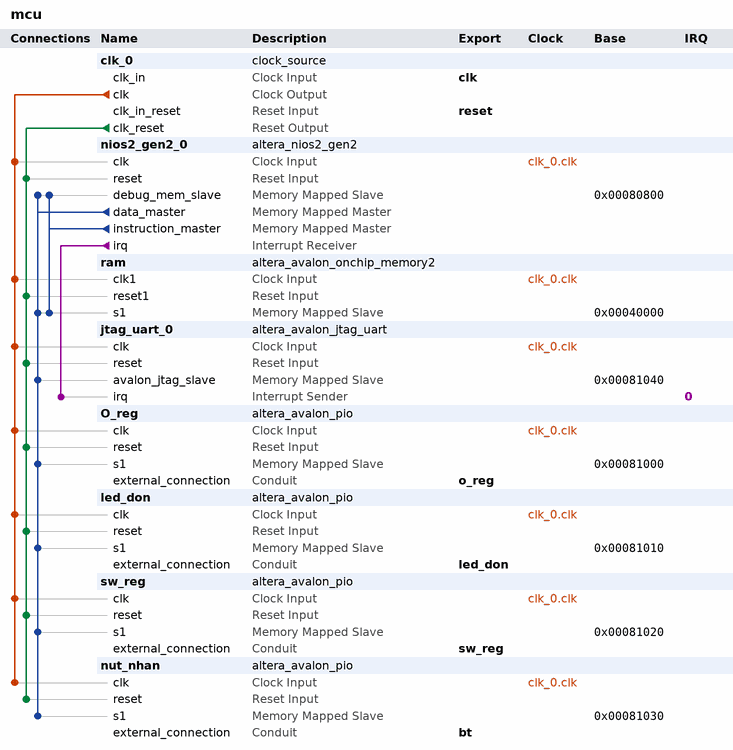
[diagram p0: system contents]
# Platform Designer (Qsys) system mcu, Cyclone IV E EP4CE115F29C7
# Parameters at their usual value, and those the tool derives, are not listed.
package require -exact qsys 17.1
create_system mcu
set_project_property DEVICE_FAMILY {Cyclone IV E}
set_project_property DEVICE EP4CE115F29C7

add_instance clk_0 clock_source 17.1
set_instance_parameter_value clk_0 clockFrequency 50000000

add_instance nios2_gen2_0 altera_nios2_gen2 17.1
set_instance_parameter_value nios2_gen2_0 dcache_size 2048
set_instance_parameter_value nios2_gen2_0 exceptionSlave ram.s1
set_instance_parameter_value nios2_gen2_0 icache_size 4096
set_instance_parameter_value nios2_gen2_0 impl Tiny
set_instance_parameter_value nios2_gen2_0 resetSlave ram.s1

add_instance ram altera_avalon_onchip_memory2 17.1
set_instance_parameter_value ram dataWidth 32
set_instance_parameter_value ram dualPort false
set_instance_parameter_value ram initMemContent true
set_instance_parameter_value ram initializationFileName onchip_mem.hex
set_instance_parameter_value ram memorySize 204800

add_instance jtag_uart_0 altera_avalon_jtag_uart 17.1
set_instance_parameter_value jtag_uart_0 simInteractiveOptions NO_INTERACTIVE_WINDOWS

add_instance O_reg altera_avalon_pio 17.1
set_instance_parameter_value O_reg direction Output
set_instance_parameter_value O_reg width 8

add_instance led_don altera_avalon_pio 17.1
set_instance_parameter_value led_don direction Output
set_instance_parameter_value led_don width 1

add_instance sw_reg altera_avalon_pio 17.1
set_instance_parameter_value sw_reg direction Input
set_instance_parameter_value sw_reg width 3

add_instance nut_nhan altera_avalon_pio 17.1
set_instance_parameter_value nut_nhan direction Input
set_instance_parameter_value nut_nhan width 1

# connections
add_connection clk_0.clk jtag_uart_0.clk clock
add_connection clk_0.clk led_don.clk clock
add_connection clk_0.clk nios2_gen2_0.clk clock
add_connection clk_0.clk nut_nhan.clk clock
add_connection clk_0.clk O_reg.clk clock
add_connection clk_0.clk ram.clk1 clock
add_connection clk_0.clk sw_reg.clk clock
add_connection clk_0.clk_reset jtag_uart_0.reset reset
add_connection clk_0.clk_reset led_don.reset reset
add_connection clk_0.clk_reset nios2_gen2_0.reset reset
add_connection clk_0.clk_reset nut_nhan.reset reset
add_connection clk_0.clk_reset O_reg.reset reset
add_connection clk_0.clk_reset ram.reset1 reset
add_connection clk_0.clk_reset sw_reg.reset reset
add_connection nios2_gen2_0.data_master jtag_uart_0.avalon_jtag_slave avalon
set_connection_parameter_value nios2_gen2_0.data_master/jtag_uart_0.avalon_jtag_slave baseAddress 0x00081040
add_connection nios2_gen2_0.data_master led_don.s1 avalon
set_connection_parameter_value nios2_gen2_0.data_master/led_don.s1 baseAddress 0x00081010
add_connection nios2_gen2_0.data_master nios2_gen2_0.debug_mem_slave avalon
set_connection_parameter_value nios2_gen2_0.data_master/nios2_gen2_0.debug_mem_slave baseAddress 0x00080800
add_connection nios2_gen2_0.data_master nut_nhan.s1 avalon
set_connection_parameter_value nios2_gen2_0.data_master/nut_nhan.s1 baseAddress 0x00081030
add_connection nios2_gen2_0.data_master O_reg.s1 avalon
set_connection_parameter_value nios2_gen2_0.data_master/O_reg.s1 baseAddress 0x00081000
add_connection nios2_gen2_0.data_master ram.s1 avalon
set_connection_parameter_value nios2_gen2_0.data_master/ram.s1 baseAddress 0x00040000
add_connection nios2_gen2_0.data_master sw_reg.s1 avalon
set_connection_parameter_value nios2_gen2_0.data_master/sw_reg.s1 baseAddress 0x00081020
add_connection nios2_gen2_0.instruction_master nios2_gen2_0.debug_mem_slave avalon
set_connection_parameter_value nios2_gen2_0.instruction_master/nios2_gen2_0.debug_mem_slave baseAddress 0x00080800
add_connection nios2_gen2_0.instruction_master ram.s1 avalon
set_connection_parameter_value nios2_gen2_0.instruction_master/ram.s1 baseAddress 0x00040000
add_connection nios2_gen2_0.irq jtag_uart_0.irq interrupt
set_connection_parameter_value nios2_gen2_0.irq/jtag_uart_0.irq irqNumber 0

# exported interfaces
add_interface bt conduit end
set_interface_property bt EXPORT_OF nut_nhan.external_connection
add_interface clk clock sink
set_interface_property clk EXPORT_OF clk_0.clk_in
add_interface led_don conduit end
set_interface_property led_don EXPORT_OF led_don.external_connection
add_interface o_reg conduit end
set_interface_property o_reg EXPORT_OF O_reg.external_connection
add_interface reset reset sink
set_interface_property reset EXPORT_OF clk_0.clk_in_reset
add_interface sw_reg conduit end
set_interface_property sw_reg EXPORT_OF sw_reg.external_connection

set_interconnect_requirement {$system} qsys_mm.clockCrossingAdapter HANDSHAKE
set_interconnect_requirement {$system} qsys_mm.enableEccProtection FALSE
set_interconnect_requirement {$system} qsys_mm.insertDefaultSlave FALSE
set_interconnect_requirement {$system} qsys_mm.maxAdditionalLatency 1

save_system mcu.qsys
